# Altium schematic sheet P2_tester.SchDoc: VME P2 tester
size 297 x 209 mm; Date: 28/08/2012; DrawnBy: mcattin; Engineer: mcattin; Address1: European Organization for Nuclear Research; Address2: CH-1211 Geneve 23 - Switzerland; Revision: 1; EDA_Number: -; Projet: SVEC; ModifiedBy: -; CreateDate: 28/08/2012; CheckedDate: -; DivGrp: BE/CO; Designer: mcattin; ProjectName: SVEC
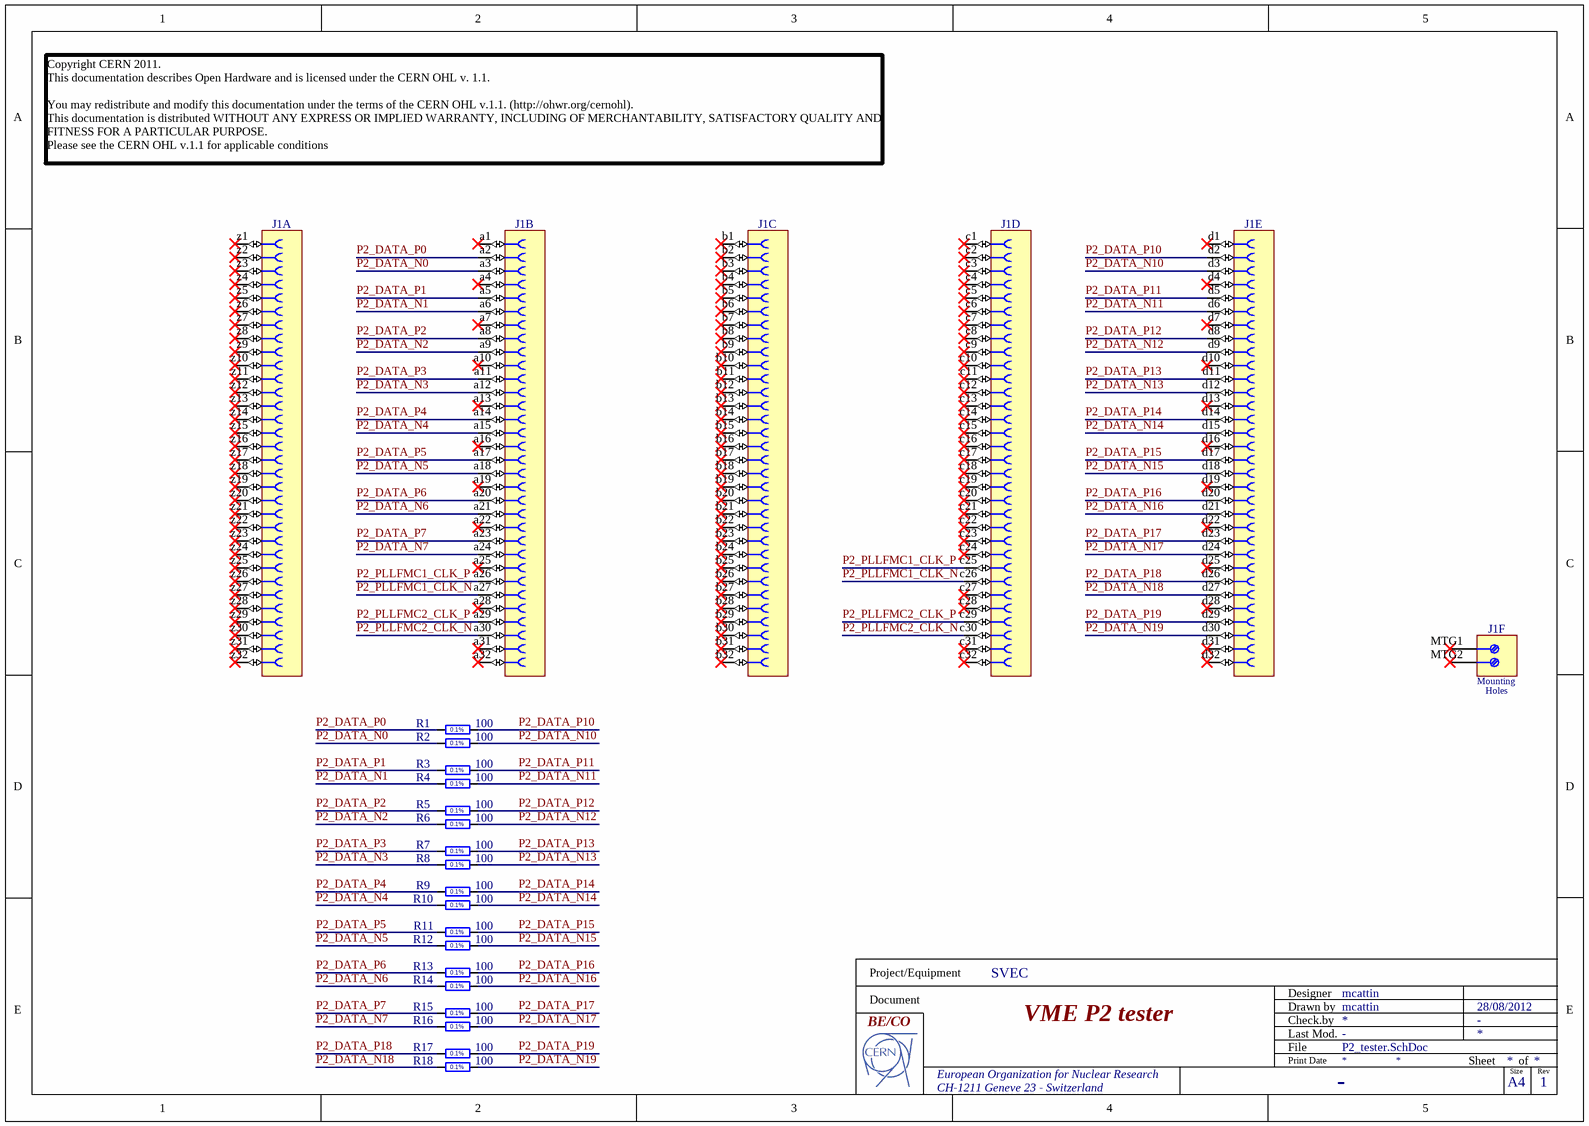
[diagram p0: P2_tester.SchDoc]

## Parts
J1  HAR-BUS 64  [HARTING_02 04 160 1101]  (value not drawn)  (parts A,B,C,D,E,F of 6)
R1  100  [RESC1608X55N]
R2  100  [RESC1608X55N]
R3  100  [RESC1608X55N]
R4  100  [RESC1608X55N]
R5  100  [RESC1608X55N]
R6  100  [RESC1608X55N]
R7  100  [RESC1608X55N]
R8  100  [RESC1608X55N]
R9  100  [RESC1608X55N]
R10  100  [RESC1608X55N]
R11  100  [RESC1608X55N]
R12  100  [RESC1608X55N]
R13  100  [RESC1608X55N]
R14  100  [RESC1608X55N]
R15  100  [RESC1608X55N]
R16  100  [RESC1608X55N]
R17  100  [RESC1608X55N]
R18  100  [RESC1608X55N]

## Nets
P2_DATA_N0: J1.a3 R2.1
P2_DATA_N1: J1.a6 R4.1
P2_DATA_N2: J1.a9 R6.1
P2_DATA_N3: J1.a12 R8.1
P2_DATA_N4: J1.a15 R10.1
P2_DATA_N5: J1.a18 R12.1
P2_DATA_N6: J1.a21 R14.1
P2_DATA_N7: J1.a24 R16.1
P2_DATA_N10: J1.d3 R2.2
P2_DATA_N11: J1.d6 R4.2
P2_DATA_N12: J1.d9 R6.2
P2_DATA_N13: J1.d12 R8.2
P2_DATA_N14: J1.d15 R10.2
P2_DATA_N15: J1.d18 R12.2
P2_DATA_N16: J1.d21 R14.2
P2_DATA_N17: J1.d24 R16.2
P2_DATA_N18: J1.d27 R18.1
P2_DATA_N19: J1.d30 R18.2
P2_DATA_P0: J1.a2 R1.1
P2_DATA_P1: J1.a5 R3.1
P2_DATA_P2: J1.a8 R5.1
P2_DATA_P3: J1.a11 R7.1
P2_DATA_P4: J1.a14 R9.1
P2_DATA_P5: J1.a17 R11.1
P2_DATA_P6: J1.a20 R13.1
P2_DATA_P7: J1.a23 R15.1
P2_DATA_P10: J1.d2 R1.2
P2_DATA_P11: J1.d5 R3.2
P2_DATA_P12: J1.d8 R5.2
P2_DATA_P13: J1.d11 R7.2
P2_DATA_P14: J1.d14 R9.2
P2_DATA_P15: J1.d17 R11.2
P2_DATA_P16: J1.d20 R13.2
P2_DATA_P17: J1.d23 R15.2
P2_DATA_P18: J1.d26 R17.1
P2_DATA_P19: J1.d29 R17.2
P2_PLLFMC1_CLK_N: J1.a27 J1.c26
P2_PLLFMC1_CLK_P: J1.a26 J1.c25
P2_PLLFMC2_CLK_N: J1.a30 J1.c30
P2_PLLFMC2_CLK_P: J1.a29 J1.c29

Not connected (* = marked no-connect by the designer): J1 a1* a4* a7* a10* a13* a16* a19* a22* a25* a28* a31* a32* b1* b2* b3* b4* b5* b6* b7* b8* b9* b10* b11* b12* b13* b14* b15* b16* b17* b18* b19* b20* b21* b22* b23* b24* b25* b26* b27* b28* b29* b30* b31* b32* c1* c2* c3* c4* c5* c6* c7* c8* c9* c10* c11* c12* c13* c14* c15* c16* c17* c18* c19* c20* c21* c22* c23* c24* c27* c28* c31* c32* d1* d4* d7* d10* d13* d16* d19* d22* d25* d28* d31* d32* MTG1* MTG2* z1* z2* z3* z4* z5* z6* z7* z8* z9* z10* z11* z12* z13* z14* z15* z16* z17* z18* z19* z20* z21* z22* z23* z24* z25* z26* z27* z28* z29* z30* z31* z32*

## Notes on the sheet
- Copyright CERN 2011.
  This documentation describes Open Hardware and is licensed under the CERN OHL v. 1.1.
  You may redistribute and modify this documentation under the terms of the CERN OHL v.1.1. (http://ohwr.org/cernohl).
  This documentation is distributed WITHOUT ANY EXPRESS OR IMPLIED WARRANTY, INCLUDING OF MERCHANTABILITY, SATISFACTORY QUALITY AND FITNESS FOR A PARTICULAR PURPOSE.
  Please see the CERN OHL v.1.1 for applicable conditions
- Project/Equipment
- Document
- Designer
- Drawn by
- Check.by
- File
- Last Mod.
- Print Date
- Sheet
- Size
- A4
- of
- Rev
- (in symbol HARTING_02 04 160 1101, part F) Mounting; Holes
- (in symbol R0603_100R_0.1%_0.063W_10PPM) 0.1%

## Library data of the parts
J1 = HARTING_02 04 160 1101: Connector 160zabcd Female (5x32); Part Description: DIN 41612, har-bus 64, 160 poles, 5 Rows z+a+b+c+d, Angled solder pins, Female contacts, Pitch 2.54mm, Performance level 1; Part Number: HARTING_02 04 160 1101; Component Kind: Standard; Component Type: Standard; Pin Count: 162; Family: HAR-BUS 64; Mounted: Yes; Socket: No; SMD: No; Status: None; Manufacturer: HARTING; Manufacturer Part Number: 02 04 160 1101; ComponentHeight: 10.7mm; HelpURL: \\cern.ch\dfs\Applications\Altium\Datasheets\HARTING_02 04 160 1101.pdf; Author: CERN DEM JLC; CreateDate: 03/11/2010; LatestRevisionDate: 03/11/2010; Table: HARTING
R1-R18 = R0603_100R_0.1%_0.063W_10PPM: Resistor - 0.1%; Part Description: Thin Film Chip Resistor; Manufacturer: GENERIC; Manufacturer1 Part Number: RN73C1J100RBTDF; Power: 0.063W; TC: ±10ppm; Table: Resistors SMD; Part Number: R0603_100R_0.1%_0.063W_10PPM; Component Kind: Standard; Component Type: Standard; Pin Count: 2; Value: 100; Status: Not recommended; Tolerance: ±0.1%; Manufacturer Part Number: R0603_100R_0.1%_0.063W_10PPM; Case: 0603; Mounted: Yes; Socket: No; SMD: Yes; Manufacturer1 Example: TYCO HOLSWORTHY; Manufacturer1 ComponentHeight: 0.5mm; HelpURL: \\cern.ch\dfs\Applications\Altium\Datasheets\R0603_Tyco_RN73.pdf; Author: CERN DEM JLC; CreateDate: 03/12/2007; LatestRevisionDate: 13/03/2008